# Altium schematic sheet Power.SchDoc
size A4; SheetNumber: 2; SheetTotal: 4
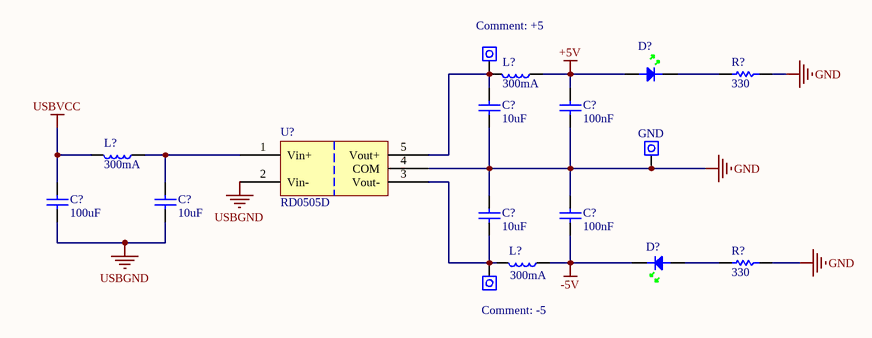
[diagram p0: Power.SchDoc]

## Parts
(Parts that share a designator on the sheet are numbered #1, #2 ... from top to bottom, then left to right.)
C?#1  10uF  [0805C]
C?#2  100nF  [0805C]
C?#3  100uF  [0805C]
C?#4  10uF  [0805C]
C?#5  10uF  [0805C]
C?#6  100nF  [0805C]
D?#1  (no value)  [0805D-GREEN]
D?#2  (no value)  [0805D-GREEN]
L?#1  300mA  [0805]
L?#2  300mA  [0805]
L?#3  300mA  [0805]
R?#1  330  [0805]
R?#2  330  [0805]
TP?#1  +5  [PIN 1.8mm]
TP?#2  GND  [PIN 1.8mm]
TP?#3  -5  [PIN 1.8mm]
U?  RD0505D  [SIP_NMG]

## Nets
+5V: C?#2.1 D?#1.A L?#1.1
-5V: C?#6.2 D?#2.K L?#3.1
GND: C?#1.2 C?#2.2 C?#5.1 C?#6.1 R?#1.1 R?#2.1 TP?#2.1 U?.4(COM)
USBGND: C?#3.2 C?#4.2 U?.2(Vin-)
USBVCC: C?#3.1 L?#2.2
NetC?#1_1: C?#1.1 L?#1.2 TP?#1.1 U?.5(Vout+)
NetC?#4_1: C?#4.1 L?#2.1 U?.1(Vin+)
NetC?#5_2: C?#5.2 L?#3.2 TP?#3.1 U?.3(Vout-)
NetD?#1_K: D?#1.K R?#1.2
NetD?#2_A: D?#2.A R?#2.2

## Library data of the parts
C?#1-C?#6 = C: Capacitor; Reviewed by: RM - 2018/08/05; Revision: July-2002: Re-released for DXP Platform.; Supplier 1: *; Supplier Part Number 1: *
  C?#1 C?#4 C?#5: Value: 10uF
  C?#2 C?#6: Value: 100nF
  C?#3: Value: 100uF
D?#1 D?#2 = LED GREEN: Light Emitting Diode; Reviewed by: RM - 2018/08/05; Revision: July-2002: Re-released for DXP Platform.; Supplier 1: Digi-Key; Supplier Part Number 1: 160-1423-1-ND
L?#1-L?#3 = I: Inductor; Reviewed by: RM - 2018/08/05; Supplier 1: *; Supplier Part Number 1: *; Value: 300mA
R?#1 R?#2 = R: Resistor; Reviewed by: RM - 2018/08/05; Supplier 1: *; Suppler Part Number 1: *; Value: 330
TP?#1-TP?#3 = WIRE: Pad
U? = RD0505D: (ADV) DC to DC converter 5V in +-5V out; Reviewed by: RM - 2018/08/05; Supplier Part Number 1: 945-1136-ND; Supplier 1: Digi-Key